# EAGLE design Digit_laidai (EAGLE 5.07)
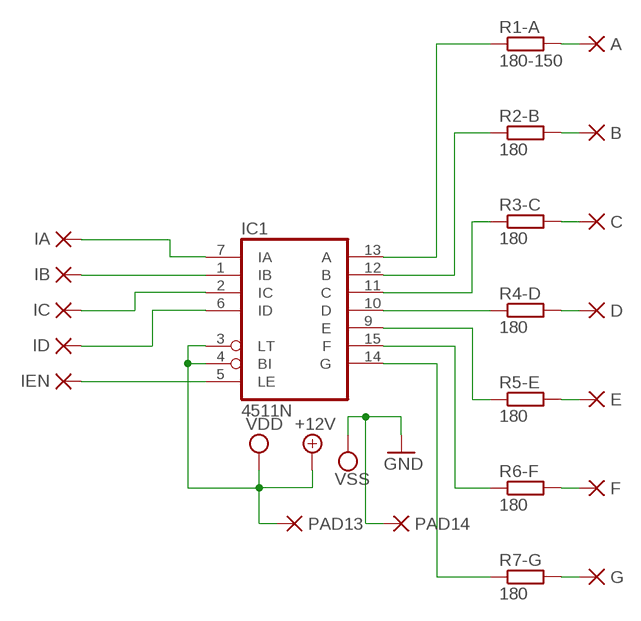
[diagram p0: schematic, sheet 1]

## Parts
A  PAD-0320  [0320]
B  PAD-0320  [0320]
C  PAD-0320  [0320]
D  PAD-0320  [0320]
E  PAD-0320  [0320]
F  PAD-0320  [0320]
G  PAD-0320  [0320]
IA  PAD-0320  [0320]
IB  PAD-0320  [0320]
IC  PAD-0320  [0320]
IC1  4511N  [DIL16]
ID  PAD-0320  [0320]
IEN  PAD-0320  [0320]
PAD13  PAD-0320  [0320]
PAD14  PAD-0320  [0320]
R1-A  180-150  R-EU_0309/12  [0309/12]
R2-B  180  R-EU_0309/12  [0309/12]
R3-C  180  R-EU_0309/12  [0309/12]
R4-D  180  R-EU_0309/12  [0309/12]
R5-E  180  R-EU_0309/12  [0309/12]
R6-F  180  R-EU_0309/12  [0309/12]
R7-G  180  R-EU_0309/12  [0309/12]

## Nets
+12V: IC1.3(LT) IC1.4(BI) PAD13.P$1(P) ; supply symbol labelled VDD
GND: PAD14.P$1(P) ; supply symbol labelled VSS
N$1: A.P$1(P) R1-A.2
N$2: B.P$1(P) R2-B.2
N$3: C.P$1(P) R3-C.2
N$4: D.P$1(P) R4-D.2
N$5: E.P$1(P) R5-E.2
N$6: F.P$1(P) R6-F.2
N$7: G.P$1(P) R7-G.2
N$29: IC1.13(A) R1-A.1
N$30: IC1.12(B) R2-B.1
N$31: IC1.11(C) R3-C.1
N$32: IC1.10(D) R4-D.1
N$33: IC1.9(E) R5-E.1
N$34: IC1.15(F) R6-F.1
N$35: IC1.14(G) R7-G.1
N$36: IB.P$1(P) IC1.1(IB)
N$37: IA.P$1(P) IC1.7(IA)
N$38: IC1.5(LE) IEN.P$1(P)
N$39: IC1.2(IC) IC.P$1(P)
N$40: IC1.6(ID) ID.P$1(P)

## Power pins joined to a net without a drawn wire
+12V: IC1.16(VDD)
GND: IC1.8(VSS)

## Library data of the parts
A B C D E F G IA IB IC ID IEN PAD13 PAD14 = ~~dpads:PAD: WIRE PAD Standard US Drill Sizes and SMD pads
IC1 = 45xx:4511: BCD to 7-segment LATCH/DECODER/DRIVER
R1-A R2-B R3-C R4-D R5-E R6-F R7-G = ~~rcl:R-EU_: RESISTOR, European symbol

## Board
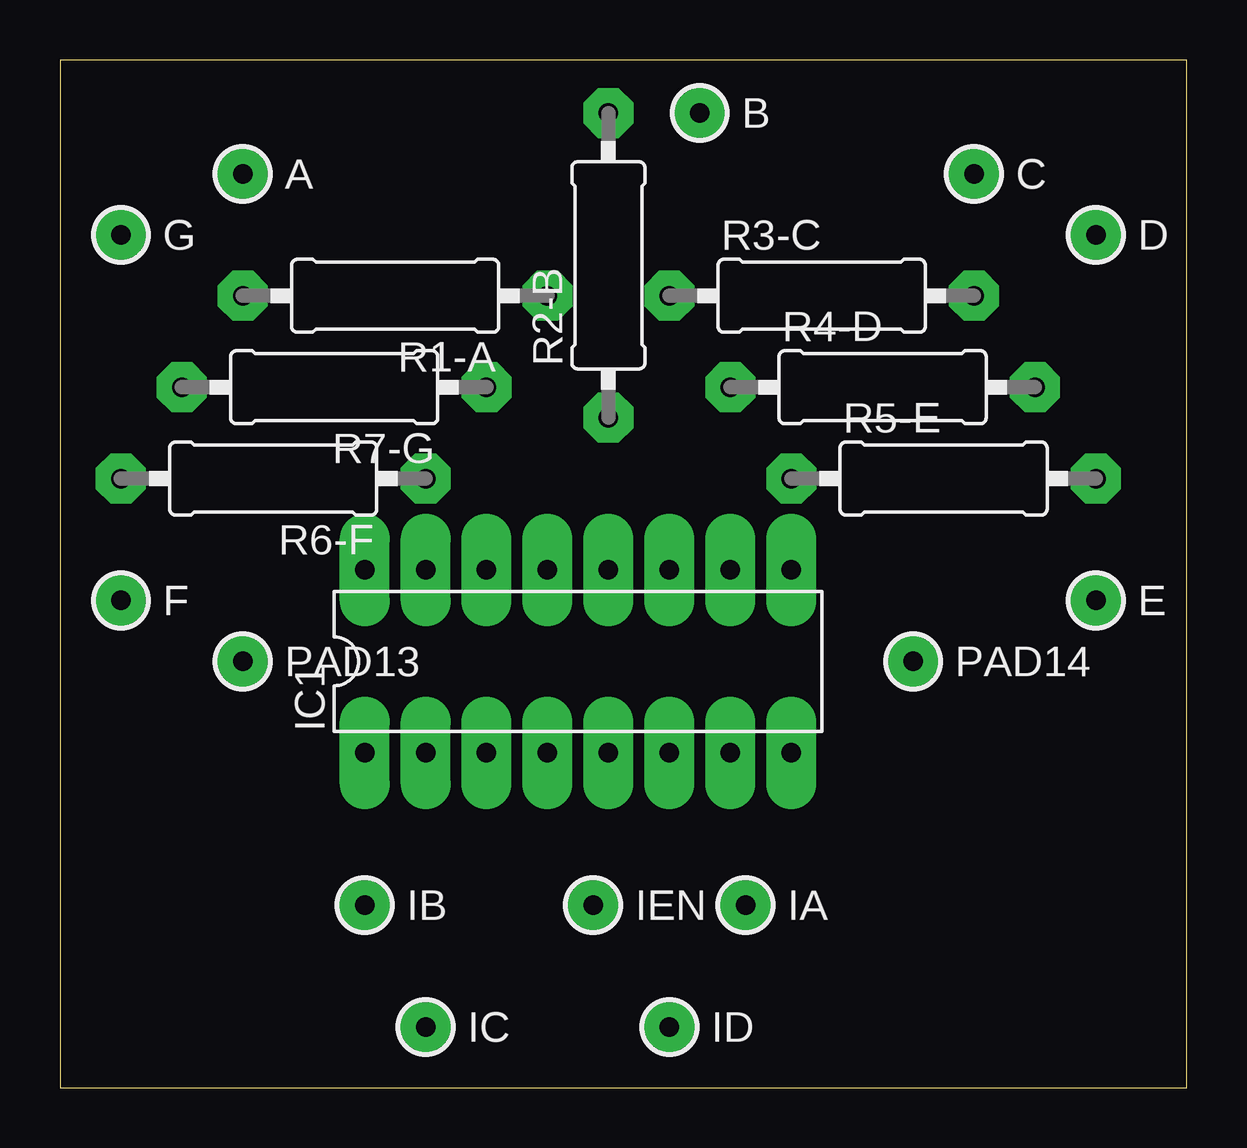
[diagram p1: board, top side]
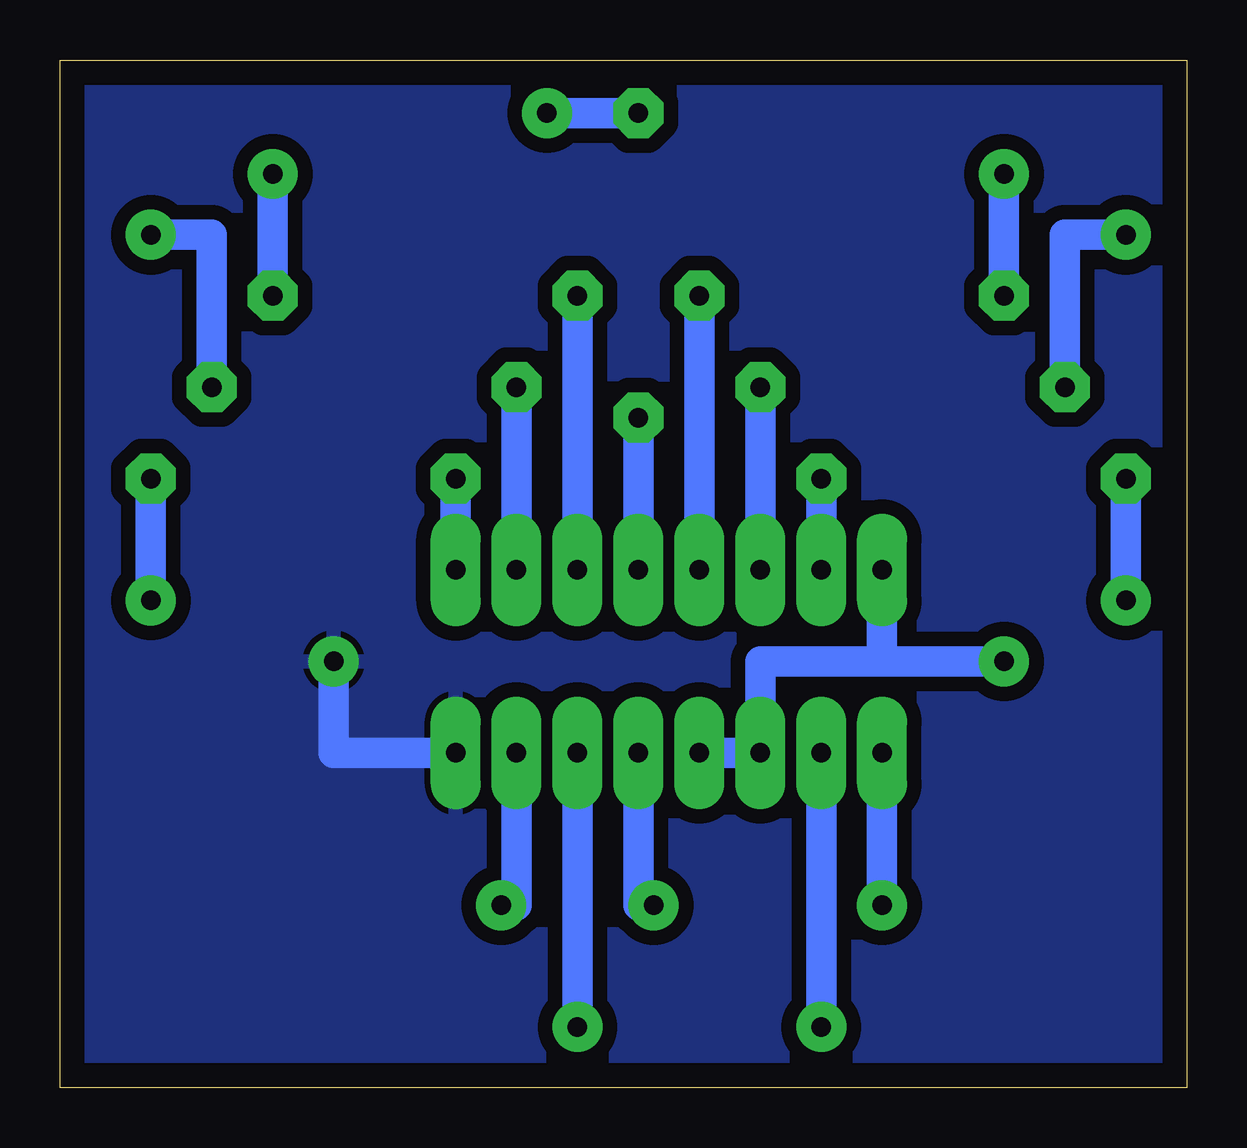
[diagram p2: board, bottom side, seen from below]

Size 46.97 x 42.85 mm. Coordinates in mm from the lower left corner, seen from the top.
Outline: 0,0 46.97,0 46.97,42.85 0,42.85 0,0
Copper layers (1*16): Top 0.035mm / dielectric 1.5mm / Bottom 0.035mm
Design rules "mano bandymas *": minimum track width 50mil, minimum drill 24mil, track to track 8mil, track to pad 8mil, pad to pad 8mil, via to via 8mil, smd to smd 8mil, copper to edge 40mil, drill to drill 8mil, minimum pad ring 25mil, minimum via ring 28mil, stop-mask expansion 4mil, vias tented up to drill 0mil, thermal gap 10mil

### Footprints (pad centres in the part's own frame; a part is rotated, then mirrored left to right if it is on the bottom)
0320 = drill 0.813 pad 1.676 round: P$1 0,0
DIL16 = drill 0.813 long: 1 -8.89,-3.81; 2 -6.35,-3.81; 3 -3.81,-3.81; 4 -1.27,-3.81; 5 1.27,-3.81; 6 3.81,-3.81; 7 6.35,-3.81; 8 8.89,-3.81; 9 8.89,3.81; 10 6.35,3.81; 11 3.81,3.81; 12 1.27,3.81; 13 -1.27,3.81; 14 -3.81,3.81; 15 -6.35,3.81; 16 -8.89,3.81
0309/12 = drill 0.813 octagon: 1 -6.35,0; 2 6.35,0

### Placement (x,y rotation side)
A  7.62,38.1 0 top
B  26.67,40.64 0 top
C  38.1,38.1 0 top
D  43.18,35.56 0 top
E  43.18,20.32 0 top
F  2.54,20.32 0 top
G  2.54,35.56 0 top
IA  28.57,7.62 0 top
IB  12.7,7.62 0 top
IC  15.24,2.54 0 top
IC1  21.59,17.78 0 top
ID  25.4,2.54 0 top
IEN  22.23,7.62 0 top
PAD13  7.62,17.78 0 top
PAD14  35.56,17.78 0 top
R1-A  13.97,33.02 180 top
R2-B  22.86,34.29 90 top
R3-C  31.75,33.02 0 top
R4-D  34.29,29.21 0 top
R5-E  36.83,25.4 0 top
R6-F  8.89,25.4 180 top
R7-G  11.43,29.21 180 top

### Tracks (layer width: path | path; a pad name or v marks a point on that pad's centre or on a via)
+12V
  Bottom 1.27: IC1.4 IC1.3 17.78,17.78 12.7,17.78 | 12.7,17.78 IC1.16 | PAD13.P$1 12.7,17.78
GND
  Bottom 1.27: IC1.8 35.56,13.97 PAD14.P$1
  pour Bottom (isolate 0.61): 0,41.91 46.99,41.91 46.99,0 0,0 0,40.64
N$1
  Bottom 1.27: R1-A.2 A.P$1
N$2
  Bottom 1.27: R2-B.2 B.P$1
N$3
  Bottom 1.27: R3-C.2 C.P$1
N$4
  Bottom 1.27: R4-D.2 40.64,35.56 D.P$1
N$5
  Bottom 1.27: E.P$1 R5-E.2
N$6
  Bottom 1.27: F.P$1 R6-F.2
N$7
  Bottom 1.27: R7-G.2 5.08,35.56 G.P$1
N$29
  Bottom 1.27: IC1.13 R1-A.1
N$30
  Bottom 1.27: IC1.12 R2-B.1
N$31
  Bottom 1.27: IC1.11 R3-C.1
N$32
  Bottom 1.27: IC1.10 R4-D.1
N$33
  Bottom 1.27: IC1.9 R5-E.1
N$34
  Bottom 1.27: IC1.15 R6-F.1
N$35
  Bottom 1.27: IC1.14 R7-G.1
N$36
  Bottom 1.27: IB.P$1 IC1.1
N$37
  Bottom 1.27: IC1.7 27.94,7.62 IA.P$1
N$38
  Bottom 1.27: IC1.5 22.86,7.62 IEN.P$1
N$39
  Bottom 1.27: IC.P$1 IC1.2
N$40
  Bottom 1.27: ID.P$1 IC1.6

### Text on the board
Raides: G | A | B | C | D | E | F | . | 2010-04-10 | OS Clock | IEN | 1.00v | IB | IA | c DK | O | IC | ID